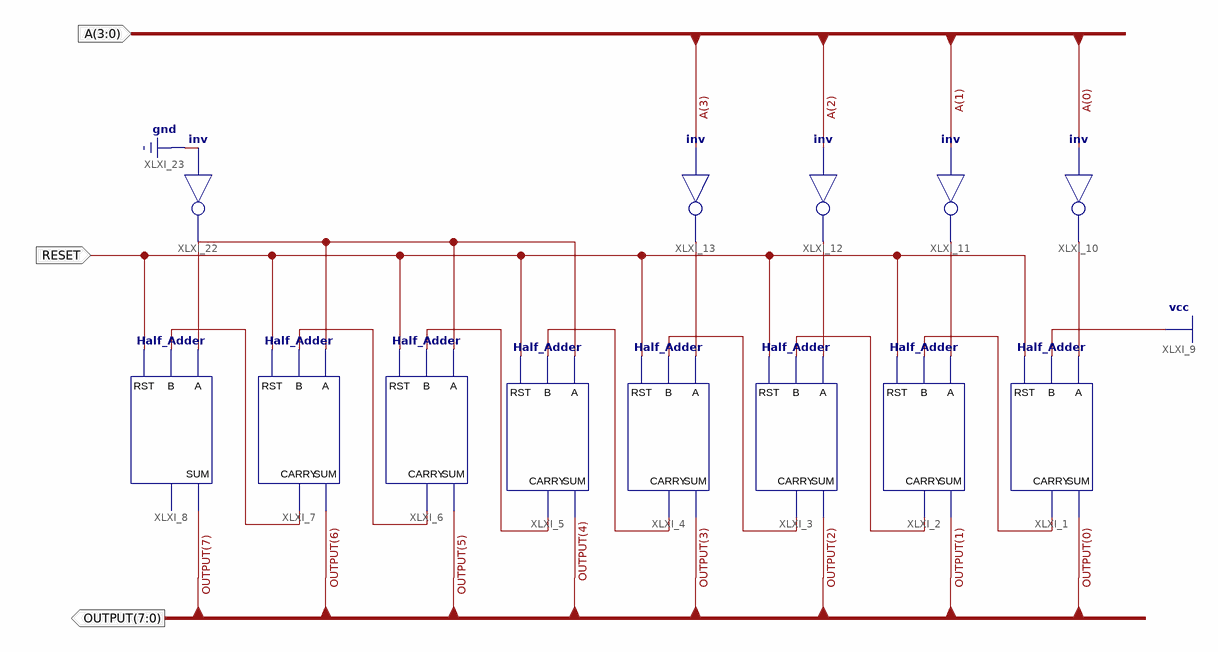
[diagram p0: schematic sheet 1]
// Xilinx ISE schematic Eight_Bit_Twos_Complement.sch (spartan6) as structural Verilog: 13 symbols, 3 ports
module Eight_Bit_Twos_Complement (
  input  RESET,
  input  [3:0] A,
  output [7:0] OUTPUT
);

  wire XLXN_2, XLXN_3, XLXN_4, XLXN_5, XLXN_9, XLXN_20, XLXN_22, XLXN_24, XLXN_26, XLXN_28, XLXN_30, XLXN_32;

  Half_Adder XLXI_1 (.A(XLXN_2), .B(1'b1), .CARRY(XLXN_20), .RST(RESET), .SUM(OUTPUT[0]));
  Half_Adder XLXI_2 (.A(XLXN_3), .B(XLXN_20), .CARRY(XLXN_22), .RST(RESET), .SUM(OUTPUT[1]));
  Half_Adder XLXI_3 (.A(XLXN_4), .B(XLXN_22), .CARRY(XLXN_24), .RST(RESET), .SUM(OUTPUT[2]));
  Half_Adder XLXI_4 (.A(XLXN_5), .B(XLXN_24), .CARRY(XLXN_26), .RST(RESET), .SUM(OUTPUT[3]));
  Half_Adder XLXI_5 (.A(XLXN_9), .B(XLXN_26), .CARRY(XLXN_28), .RST(RESET), .SUM(OUTPUT[4]));
  Half_Adder XLXI_6 (.A(XLXN_9), .B(XLXN_28), .CARRY(XLXN_30), .RST(RESET), .SUM(OUTPUT[5]));
  Half_Adder XLXI_7 (.A(XLXN_9), .B(XLXN_30), .CARRY(XLXN_32), .RST(RESET), .SUM(OUTPUT[6]));
  Half_Adder XLXI_8 (.A(XLXN_9), .B(XLXN_32), .RST(RESET), .SUM(OUTPUT[7]));  // open: CARRY
  not XLXI_10 (XLXN_2, A[0]);
  not XLXI_11 (XLXN_3, A[1]);
  not XLXI_13 (XLXN_5, A[3]);
  not XLXI_12 (XLXN_4, A[2]);
  not XLXI_22 (XLXN_9, 1'b0);
endmodule
